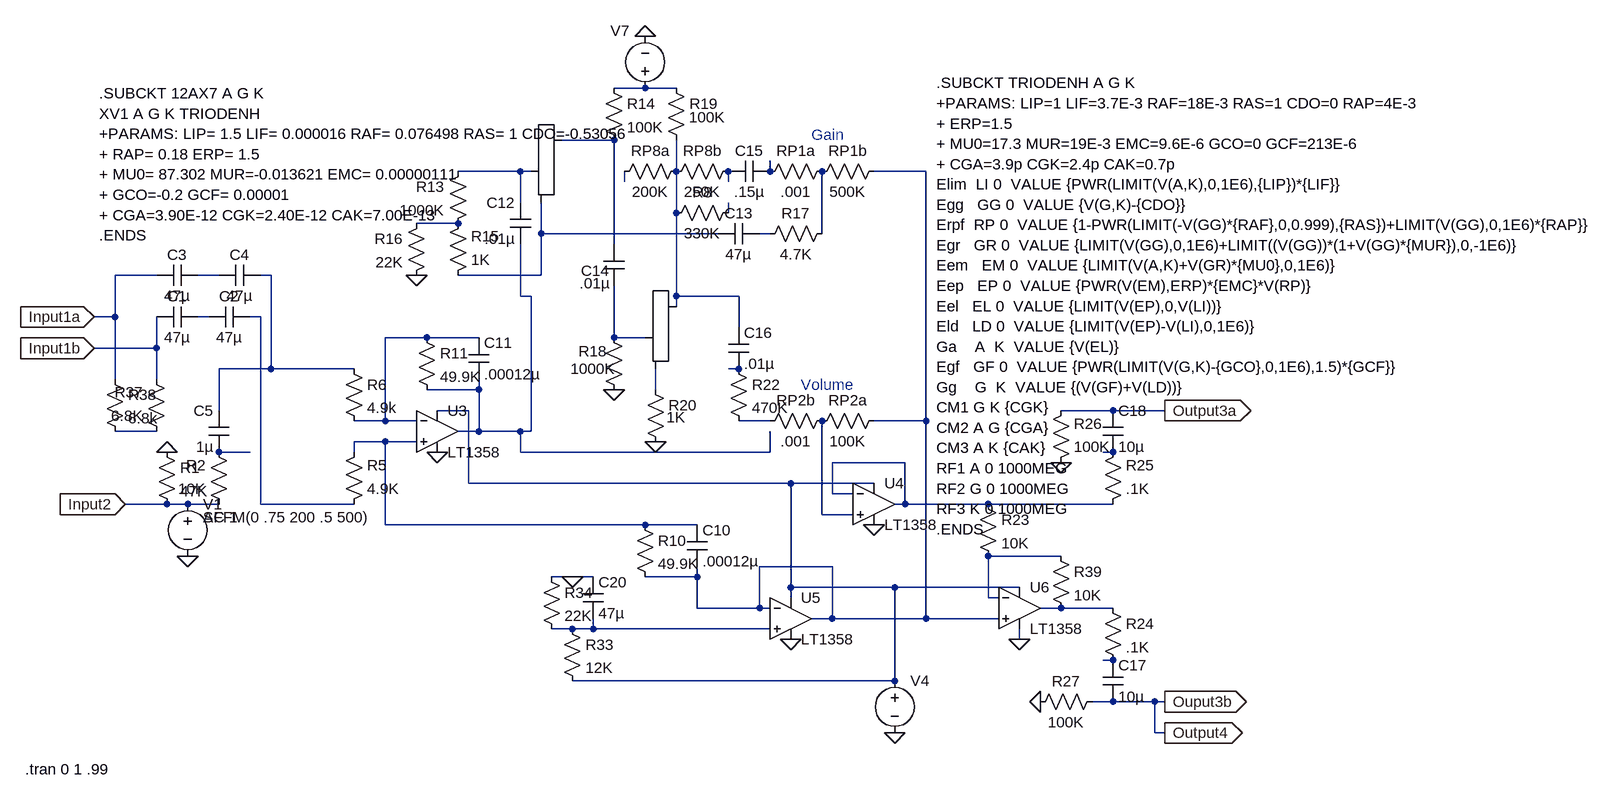
[diagram p0: schematic MP105AlteredLTSpice.asc]
MP105AlteredLTSpice.asc, the LTspice schematic file:
Version 4
SHEET 1 2332 2500
WIRE -640 1104 -672 1104
WIRE -640 1104 -640 1040
WIRE -640 1200 -640 1104
WIRE -576 1040 -640 1040
WIRE -576 1152 -672 1152
WIRE -576 1152 -576 1104
WIRE -576 1200 -576 1152
WIRE -576 1280 -640 1280
WIRE -560 1392 -624 1392
WIRE -528 1392 -560 1392
WIRE -496 1104 -512 1104
WIRE -480 1040 -512 1040
WIRE -480 1248 -480 1184
WIRE -480 1392 -528 1392
WIRE -432 1312 -480 1312
WIRE -416 1104 -432 1104
WIRE -416 1392 -416 1104
WIRE -400 1040 -416 1040
WIRE -400 1184 -480 1184
WIRE -400 1184 -400 1040
WIRE -272 1184 -400 1184
WIRE -272 1312 -272 1296
WIRE -272 1392 -416 1392
WIRE -224 1264 -272 1264
WIRE -224 1264 -224 1136
WIRE -224 1296 -272 1296
WIRE -224 1424 -224 1296
WIRE -176 1264 -224 1264
WIRE -176 1296 -224 1296
WIRE -160 1136 -224 1136
WIRE -112 960 -176 960
WIRE -96 1248 -144 1248
WIRE -96 1360 -96 1248
WIRE -80 1136 -160 1136
WIRE -80 1216 -160 1216
WIRE -80 1216 -80 1200
WIRE -80 1280 -112 1280
WIRE -80 1280 -80 1216
WIRE -16 880 -112 880
WIRE -16 928 -16 880
WIRE -16 1072 -16 992
WIRE -16 1280 -80 1280
WIRE -16 1312 -16 1280
WIRE 0 880 -16 880
WIRE 0 1072 -16 1072
WIRE 0 1280 -16 1280
WIRE 0 1280 0 1072
WIRE 16 976 16 928
WIRE 16 1040 -112 1040
WIRE 16 1040 16 976
WIRE 64 1504 32 1504
WIRE 64 1584 32 1584
WIRE 96 1504 64 1504
WIRE 96 1584 64 1584
WIRE 96 1584 96 1568
WIRE 128 832 48 832
WIRE 128 992 128 832
WIRE 128 1136 128 1056
WIRE 144 896 144 880
WIRE 176 752 128 752
WIRE 176 1136 128 1136
WIRE 176 1424 -224 1424
WIRE 192 1216 192 1184
WIRE 224 752 176 752
WIRE 224 880 224 832
WIRE 224 944 224 880
WIRE 224 1072 224 944
WIRE 224 1088 224 1072
WIRE 256 1424 176 1424
WIRE 256 1504 176 1504
WIRE 256 1504 256 1488
WIRE 256 1552 256 1504
WIRE 288 976 16 976
WIRE 304 896 304 880
WIRE 304 944 304 928
WIRE 320 1072 224 1072
WIRE 320 1120 320 1072
WIRE 320 1184 304 1184
WIRE 352 1552 256 1552
WIRE 352 1552 352 1488
WIRE 368 880 368 864
WIRE 368 976 352 976
WIRE 368 1264 320 1264
WIRE 368 1312 -16 1312
WIRE 368 1312 368 1280
WIRE 368 1552 352 1552
WIRE 368 1584 96 1584
WIRE 400 1360 -96 1360
WIRE 400 1520 400 1360
WIRE 400 1536 400 1520
WIRE 448 976 448 880
WIRE 448 1408 448 1264
WIRE 464 1376 464 1328
WIRE 464 1488 352 1488
WIRE 464 1568 432 1568
WIRE 464 1568 464 1488
WIRE 496 1376 464 1376
WIRE 496 1408 448 1408
WIRE 528 1360 400 1360
WIRE 560 1520 400 1520
WIRE 560 1664 64 1664
WIRE 560 1664 560 1520
WIRE 576 1328 464 1328
WIRE 576 1392 560 1392
WIRE 576 1392 576 1328
WIRE 608 880 528 880
WIRE 608 1264 528 1264
WIRE 608 1264 608 880
WIRE 608 1568 464 1568
WIRE 608 1568 608 1264
WIRE 704 1392 576 1392
WIRE 704 1536 704 1472
WIRE 720 1536 704 1536
WIRE 720 1568 608 1568
WIRE 752 1520 560 1520
WIRE 752 1600 752 1584
WIRE 816 1472 704 1472
WIRE 816 1552 784 1552
WIRE 896 1248 816 1248
WIRE 896 1312 880 1312
WIRE 896 1392 704 1392
WIRE 896 1552 816 1552
WIRE 896 1632 880 1632
WIRE 896 1696 864 1696
WIRE 960 1696 896 1696
WIRE 960 1744 960 1696
WIRE 976 1248 896 1248
WIRE 976 1696 960 1696
WIRE 976 1744 960 1744
FLAG 976 1248 Output3a
IOPIN 976 1248 Out
FLAG 976 1696 Ouput3b
IOPIN 976 1696 Out
FLAG 976 1744 Output4
IOPIN 976 1744 Out
FLAG -624 1392 Input2
IOPIN -624 1392 In
FLAG -672 1104 Input1a
IOPIN -672 1104 In
FLAG -672 1152 Input1b
IOPIN -672 1152 In
FLAG 560 1744 0
FLAG -560 1312 0
FLAG 64 1504 0
FLAG 400 1600 0
FLAG 752 1600 0
FLAG 784 1696 0
FLAG 816 1328 0
FLAG 528 1424 0
FLAG -144 1312 0
FLAG 128 1216 0
FLAG 176 672 0
FLAG -528 1472 0
FLAG 192 1296 0
FLAG -176 1040 0
SYMBOL res 208 736 R0
WINDOW 3 35 61 Left 0
SYMATTR Value 100K
SYMATTR InstName R19
SYMBOL res 112 736 R0
SYMATTR InstName R14
SYMATTR Value 100K
SYMBOL cap 352 960 R90
WINDOW 0 0 32 VBottom 0
WINDOW 3 32 32 VTop 0
SYMATTR InstName C13
SYMATTR Value 47µ
SYMATTR SpiceLine V=63 Rser=0 Rpar=0
SYMBOL res -128 1056 M180
WINDOW 0 36 76 Left 0
WINDOW 3 36 40 Left 0
SYMATTR InstName R15
SYMATTR Value 1K
SYMBOL res -160 944 M0
SYMATTR InstName R16
SYMATTR Value 22K
SYMBOL res -96 864 M0
SYMATTR InstName R13
SYMATTR Value 1000K
SYMBOL cap 0 992 R180
WINDOW 0 24 64 Left 0
WINDOW 3 24 8 Left 0
SYMATTR InstName C12
SYMATTR Value .01µ
SYMATTR SpiceLine Rser=0 Rpar=0
SYMBOL res 176 1200 R0
WINDOW 3 33 58 Left 0
SYMATTR Value 1K
SYMATTR InstName R20
SYMBOL res 112 1120 R0
WINDOW 0 -39 37 Left 0
WINDOW 3 -51 64 Left 0
SYMATTR InstName R18
SYMATTR Value 1000K
SYMBOL cap 112 992 R0
WINDOW 3 -37 60 Left 0
WINDOW 0 -35 41 Left 0
SYMATTR Value .01µ
SYMATTR InstName C14
SYMBOL res -176 1120 R0
SYMATTR InstName R11
SYMATTR Value 49.9K
SYMBOL cap -96 1136 R0
SYMATTR InstName C11
SYMATTR Value .00012µ
SYMATTR SpiceLine Rser=0 Rpar=0
SYMBOL res -288 1168 R0
SYMATTR InstName R6
SYMATTR Value 4.9k
SYMBOL cap -464 1312 R180
WINDOW 0 24 64 Left 0
WINDOW 3 24 8 Left 0
SYMATTR InstName C5
SYMATTR Value 1µ
SYMATTR SpiceLine Rser=0 Rpar=0
SYMBOL res -464 1408 R180
WINDOW 0 36 76 Left 0
WINDOW 3 36 40 Left 0
SYMATTR InstName R2
SYMATTR Value 10K
SYMBOL res -576 1296 R0
SYMATTR InstName R1
SYMATTR Value 47K
SYMBOL cap -416 1024 R90
WINDOW 0 0 32 VBottom 0
WINDOW 3 32 32 VTop 0
SYMATTR InstName C4
SYMATTR Value 47µ
SYMATTR SpiceLine V=63 Rser=0 Rpar=0
SYMBOL cap -512 1024 R90
WINDOW 0 0 32 VBottom 0
WINDOW 3 32 32 VTop 0
SYMATTR InstName C3
SYMATTR Value 47µ
SYMATTR SpiceLine V=63v Rser=0 Rpar=0
SYMBOL cap -496 1120 R270
WINDOW 0 32 32 VTop 0
WINDOW 3 0 32 VBottom 0
SYMATTR InstName C2
SYMATTR Value 47µ
SYMATTR SpiceLine V=63 Rser=0 Rpar=0
SYMBOL cap -576 1120 R270
WINDOW 0 32 32 VTop 0
WINDOW 3 0 32 VBottom 0
SYMATTR InstName C1
SYMATTR Value 47µ
SYMATTR SpiceLine V=63 Rser=0 Rpar=0
SYMBOL res -656 1184 R0
SYMATTR InstName R38
SYMATTR Value 6.8k
SYMBOL res -560 1296 R180
WINDOW 0 36 76 Left 0
WINDOW 3 36 40 Left 0
SYMATTR InstName R37
SYMATTR Value 6.8K
SYMBOL res -288 1408 M180
WINDOW 0 36 76 Left 0
WINDOW 3 36 40 Left 0
SYMATTR InstName R5
SYMATTR Value 4.9K
SYMBOL res 160 1408 R0
SYMATTR InstName R10
SYMATTR Value 49.9K
SYMBOL cap 240 1424 R0
SYMATTR InstName C10
SYMATTR Value .00012µ
SYMATTR SpiceLine Rser=0 Rpar=0
SYMBOL cap 80 1504 R0
SYMATTR InstName C20
SYMATTR Value 47µ
SYMATTR SpiceLine Rser=0 Rpar=0
SYMBOL res 16 1488 R0
SYMATTR InstName R34
SYMATTR Value 22K
SYMBOL res 48 1568 R0
SYMATTR InstName R33
SYMATTR Value 12K
SYMBOL res 688 1376 R0
SYMATTR InstName R23
SYMATTR Value 10K
SYMBOL res 800 1456 R0
SYMATTR InstName R39
SYMATTR Value 10K
SYMBOL res 880 1536 R0
SYMATTR InstName R24
SYMATTR Value .1K
SYMBOL res 880 1408 M180
WINDOW 0 36 76 Left 0
WINDOW 3 36 40 Left 0
SYMATTR InstName R25
SYMATTR Value .1K
SYMBOL cap 880 1312 M180
WINDOW 0 24 64 Left 0
WINDOW 3 24 8 Left 0
SYMATTR InstName C18
SYMATTR Value 10µ
SYMATTR SpiceLine Rser=0 Rpar=0
SYMBOL cap 880 1632 R0
SYMATTR InstName C17
SYMATTR Value 10µ
SYMATTR SpiceLine Rser=0 Rpar=0
SYMBOL res 768 1712 R270
WINDOW 0 32 56 VTop 0
WINDOW 3 0 56 VBottom 0
SYMATTR InstName R27
SYMATTR Value 100K
SYMBOL res 800 1344 M180
WINDOW 0 36 76 Left 0
WINDOW 3 36 40 Left 0
SYMATTR InstName R26
SYMATTR Value 100K
SYMBOL voltage 560 1648 R0
WINDOW 3 24 104 Invisible 0
WINDOW 123 0 0 Left 0
WINDOW 39 0 0 Left 0
SYMATTR Value 12
SYMATTR InstName V4
SYMBOL voltage 176 768 R180
WINDOW 0 24 104 Left 0
WINDOW 3 24 16 Invisible 0
WINDOW 123 0 0 Left 0
WINDOW 39 0 0 Left 0
SYMATTR InstName V7
SYMATTR Value 122
SYMBOL voltage -528 1376 R0
WINDOW 39 0 0 Left 0
WINDOW 123 24 36 Left 0
WINDOW 3 24 36 Left 0
SYMATTR Value2 AC 1
SYMATTR Value SFFM(0 .75 200 .5 500)
SYMATTR InstName V1
SYMBOL res 432 1280 R270
WINDOW 0 32 56 VTop 0
WINDOW 3 0 56 VBottom 0
SYMATTR InstName RP2a
SYMATTR Value 100K
SYMBOL res 352 1280 R270
WINDOW 0 32 56 VTop 0
WINDOW 3 0 56 VBottom 0
SYMATTR InstName RP2b
SYMATTR Value .001
SYMBOL Misc\\triode 48 880 R0
WINDOW 0 8 -64 Invisible 0
WINDOW 3 -24 64 Invisible 0
SYMATTR InstName U1
SYMATTR Value 12AX7
SYMATTR Value2 12AX7
SYMBOL Misc\\triode 224 1136 R0
WINDOW 0 8 -64 Invisible 0
WINDOW 3 -24 64 Invisible 0
SYMATTR InstName U2
SYMATTR Value 12AX7
SYMATTR Value2 12AX7
SYMBOL res 304 1168 R0
SYMATTR InstName R22
SYMATTR Value 470K
SYMBOL cap 304 1120 R0
SYMATTR InstName C16
SYMATTR Value .01µ
SYMATTR SpiceLine Rser=0 Rpar=0
SYMBOL Opamps\\LT1358 -144 1216 R0
SYMATTR InstName U3
SYMBOL Opamps\\LT1358 528 1328 R0
SYMATTR InstName U4
SYMBOL Opamps\\LT1358 400 1504 R0
SYMATTR InstName U5
SYMBOL Opamps\\LT1358 752 1488 R0
SYMATTR InstName U6
SYMBOL res 208 896 R270
WINDOW 3 0 56 VBottom 0
WINDOW 0 32 56 VTop 0
SYMATTR Value 250K
SYMATTR InstName RP8b
SYMBOL res 352 896 R270
WINDOW 0 32 56 VTop 0
WINDOW 3 0 56 VBottom 0
SYMATTR InstName RP1a
SYMATTR Value .001
SYMBOL res 432 896 R270
WINDOW 0 32 56 VTop 0
WINDOW 3 0 56 VBottom 0
SYMATTR InstName RP1b
SYMATTR Value 500K
SYMBOL cap 304 896 R270
WINDOW 0 32 32 VTop 0
WINDOW 3 0 32 VBottom 0
SYMATTR InstName C15
SYMATTR Value .15µ
SYMBOL res 240 864 R90
WINDOW 0 0 56 VBottom 0
WINDOW 3 32 56 VTop 0
SYMATTR InstName RP8a
SYMATTR Value 200K
SYMBOL res 464 960 R90
WINDOW 0 0 56 VBottom 0
WINDOW 3 32 56 VTop 0
SYMATTR InstName R17
SYMATTR Value 4.7K
SYMBOL res 320 928 R90
WINDOW 0 0 56 VBottom 0
WINDOW 3 32 56 VTop 0
SYMATTR InstName R8
SYMATTR Value 330K
TEXT -664 760 Left 0 !.SUBCKT 12AX7 A G K\nXV1 A G K TRIODENH\n+PARAMS: LIP= 1.5 LIF= 0.000016 RAF= 0.076498 RAS= 1 CDO=-0.53056 \n+ RAP= 0.18 ERP= 1.5 \n+ MU0= 87.302 MUR=-0.013621 EMC= 0.00000111 \n+ GCO=-0.2 GCF= 0.00001 \n+ CGA=3.90E-12 CGK=2.40E-12 CAK=7.00E-13\n.ENDS
TEXT 624 744 Left 0 !.SUBCKT TRIODENH A G K\n+PARAMS: LIP=1 LIF=3.7E-3 RAF=18E-3 RAS=1 CDO=0 RAP=4E-3\n+ ERP=1.5\n+ MU0=17.3 MUR=19E-3 EMC=9.6E-6 GCO=0 GCF=213E-6\n+ CGA=3.9p CGK=2.4p CAK=0.7p \nElim  LI 0  VALUE {PWR(LIMIT(V(A,K),0,1E6),{LIP})*{LIF}}\nEgg   GG 0  VALUE {V(G,K)-{CDO}}\nErpf  RP 0  VALUE {1-PWR(LIMIT(-V(GG)*{RAF},0,0.999),{RAS})+LIMIT(V(GG),0,1E6)*{RAP}}\nEgr   GR 0  VALUE {LIMIT(V(GG),0,1E6)+LIMIT((V(GG))*(1+V(GG)*{MUR}),0,-1E6)}\nEem   EM 0  VALUE {LIMIT(V(A,K)+V(GR)*{MU0},0,1E6)}\nEep   EP 0  VALUE {PWR(V(EM),ERP)*{EMC}*V(RP)}\nEel   EL 0  VALUE {LIMIT(V(EP),0,V(LI))}\nEld   LD 0  VALUE {LIMIT(V(EP)-V(LI),0,1E6)}\nGa    A  K  VALUE {V(EL)}\nEgf   GF 0  VALUE {PWR(LIMIT(V(G,K)-{GCO},0,1E6),1.5)*{GCF}}\nGg    G  K  VALUE {(V(GF)+V(LD))}\nCM1 G K {CGK}\nCM2 A G {CGA}\nCM3 A K {CAK}\nRF1 A 0 1000MEG\nRF2 G 0 1000MEG\nRF3 K 0 1000MEG\n.ENDS
TEXT 416 1208 Left 0 ;Volume
TEXT 432 824 Left 0 ;Gain
TEXT -778 1800 Left 0 !.tran 0 1 .99

The netlist it stands for:
* MP105AlteredLTSpice.asc
R19 N018 N020 100K
R14 N018 N015 100K
C13 N026 N013 47µ V=63 Rser=0 Rpar=0
R15 N013 N009 1K
R16 N009 0 22K
R13 N012 N009 1000K
C12 N011 N012 .01µ Rser=0 Rpar=0
R20 N019 0 1K
R18 N016 0 1000K
C14 N015 N016 .01µ
R11 N008 N011 49.9K
C11 N008 N011 .00012µ Rser=0 Rpar=0
R6 N004 N008 4.9k
C5 N005 N004 1µ Rser=0 Rpar=0
R2 Input2 N005 10K
R1 0 Input2 47K
C4 N004 N003 47µ V=63 Rser=0 Rpar=0
C3 N003 Input1a 47µ V=63v Rser=0 Rpar=0
C2 N002 N006 47µ V=63 Rser=0 Rpar=0
C1 Input1b N002 47µ V=63 Rser=0 Rpar=0
R38 Input1a N001 6.8k
R37 N001 Input1b 6.8K
R5 N006 N007 4.9K
R10 N007 N021 49.9K
C10 N007 N021 .00012µ Rser=0 Rpar=0
C20 0 N014 47µ Rser=0 Rpar=0
R34 0 N014 22K
R33 N014 N010 12K
R23 N030 N031 10K
R39 N031 N032 10K
R24 N032 N034 .1K
R25 N030 N033 .1K
C18 N033 Output3a 10µ Rser=0 Rpar=0
C17 N034 Output4 10µ Rser=0 Rpar=0
R27 0 Output4 100K
R26 0 Output3a 100K
V4 N010 0 12
V7 N018 0 122
V1 Input2 0 SFFM(0 .75 200 .5 500) AC 1
RP2a N029 N021 100K
RP2b N027 N029 .001
XU1 N015 N012 N013 12AX7 12AX7
XU2 N020 N016 N019 12AX7 12AX7
R22 N024 N027 470K
C16 N020 N024 .01µ Rser=0 Rpar=0
XU3 N007 N008 N010 0 N011 LT1357  ; LT1358, pins In+ In- V+ V- OUT
XU4 N029 N030 N010 0 N030 LT1357  ; LT1358, pins In+ In- V+ V- OUT
XU5 N014 N021 N010 0 N021 LT1357  ; LT1358, pins In+ In- V+ V- OUT
XU6 N021 N031 N010 0 N032 LT1357  ; LT1358, pins In+ In- V+ V- OUT
RP8b N020 N022 250K
RP1a N025 N028 .001
RP1b N028 N021 500K
C15 N022 N025 .15µ
RP8a N020 N017 200K
R17 N028 N026 4.7K
R8 N023 N020 330K
.SUBCKT 12AX7 A G K
XV1 A G K TRIODENH
+PARAMS: LIP= 1.5 LIF= 0.000016 RAF= 0.076498 RAS= 1 CDO=-0.53056
+ RAP= 0.18 ERP= 1.5
+ MU0= 87.302 MUR=-0.013621 EMC= 0.00000111
+ GCO=-0.2 GCF= 0.00001
+ CGA=3.90E-12 CGK=2.40E-12 CAK=7.00E-13
.ENDS
.SUBCKT TRIODENH A G K
+PARAMS: LIP=1 LIF=3.7E-3 RAF=18E-3 RAS=1 CDO=0 RAP=4E-3
+ ERP=1.5
+ MU0=17.3 MUR=19E-3 EMC=9.6E-6 GCO=0 GCF=213E-6
+ CGA=3.9p CGK=2.4p CAK=0.7p
Elim  LI 0  VALUE {PWR(LIMIT(V(A,K),0,1E6),{LIP})*{LIF}}
Egg   GG 0  VALUE {V(G,K)-{CDO}}
Erpf  RP 0  VALUE {1-PWR(LIMIT(-V(GG)*{RAF},0,0.999),{RAS})+LIMIT(V(GG),0,1E6)*{RAP}}
Egr   GR 0  VALUE {LIMIT(V(GG),0,1E6)+LIMIT((V(GG))*(1+V(GG)*{MUR}),0,-1E6)}
Eem   EM 0  VALUE {LIMIT(V(A,K)+V(GR)*{MU0},0,1E6)}
Eep   EP 0  VALUE {PWR(V(EM),ERP)*{EMC}*V(RP)}
Eel   EL 0  VALUE {LIMIT(V(EP),0,V(LI))}
Eld   LD 0  VALUE {LIMIT(V(EP)-V(LI),0,1E6)}
Ga    A  K  VALUE {V(EL)}
Egf   GF 0  VALUE {PWR(LIMIT(V(G,K)-{GCO},0,1E6),1.5)*{GCF}}
Gg    G  K  VALUE {(V(GF)+V(LD))}
CM1 G K {CGK}
CM2 A G {CGA}
CM3 A K {CAK}
RF1 A 0 1000MEG
RF2 G 0 1000MEG
RF3 K 0 1000MEG
.ENDS
* Volume
* Gain
.tran 0 1 .99
.lib LTC.lib
.backanno
.end